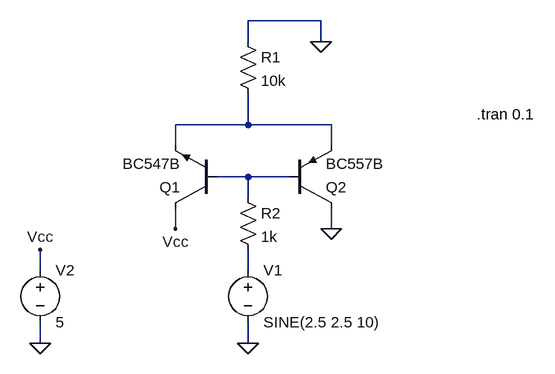
[diagram p0: schematic Buffer.asc]
Buffer.asc, the LTspice schematic file:
Version 4
SHEET 1 880 680
WIRE 144 -64 32 -64
WIRE 32 -32 32 -64
WIRE 144 -32 144 -64
WIRE 32 96 32 48
WIRE 32 96 -80 96
WIRE 160 96 32 96
WIRE -80 128 -80 96
WIRE 160 128 160 96
WIRE 32 176 -16 176
WIRE 96 176 32 176
WIRE 32 208 32 176
WIRE -80 256 -80 224
WIRE 160 256 160 224
WIRE -288 320 -288 288
WIRE 32 320 32 288
WIRE -288 432 -288 400
WIRE 32 432 32 400
FLAG 160 256 0
FLAG -288 432 0
FLAG 144 -32 0
FLAG -288 288 Vcc
FLAG -80 256 Vcc
FLAG 32 432 0
SYMBOL npn -16 224 R180
SYMATTR InstName Q1
SYMATTR Value BC547B
SYMBOL pnp 96 224 M180
SYMATTR InstName Q2
SYMATTR Value BC557B
SYMBOL voltage 32 304 R0
WINDOW 123 0 0 Left 0
WINDOW 39 0 0 Left 0
SYMATTR InstName V1
SYMATTR Value SINE(2.5 2.5 10)
SYMBOL voltage -288 304 R0
WINDOW 123 0 0 Left 0
WINDOW 39 0 0 Left 0
SYMATTR InstName V2
SYMATTR Value 5
SYMBOL res 16 -48 R0
SYMATTR InstName R1
SYMATTR Value 10k
SYMBOL res 16 192 R0
SYMATTR InstName R2
SYMATTR Value 1k
TEXT 384 80 Left 2 !.tran 0.1

The netlist it stands for:
* Buffer.asc
Q1 Vcc N002 N001 0 BC547B
Q2 0 N002 N001 0 BC557B
V1 N003 0 SINE(2.5 2.5 10)
V2 Vcc 0 5
R1 0 N001 10k
R2 N002 N003 1k
.model NPN NPN
.model PNP PNP
.lib standard.bjt
.tran 0.1
.backanno
.end